# EAGLE design taad (EAGLE 6.2)
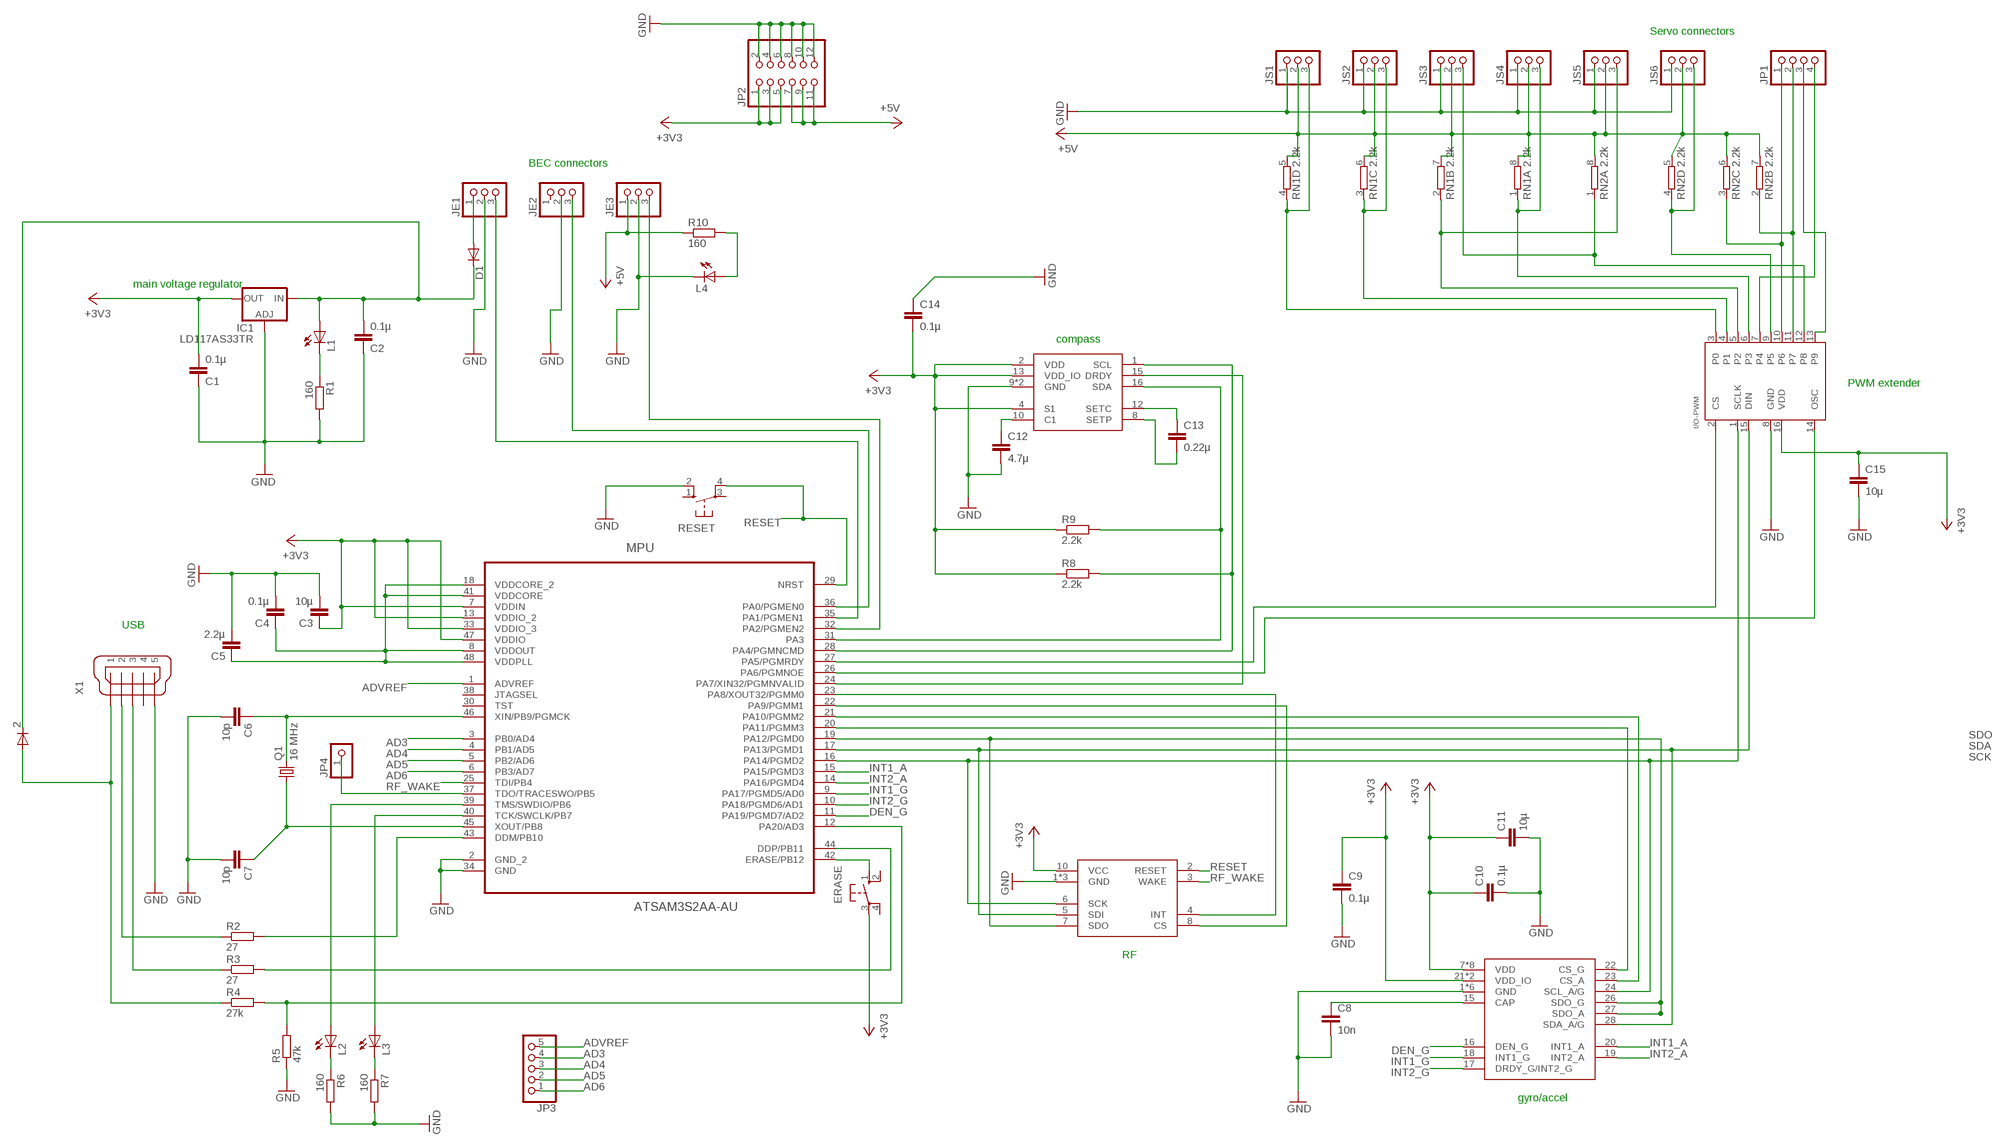
[diagram p0: schematic, sheet 1]

## Parts
2  DIODE-SOD123  [SOD123]
C1  0.1µ  C-EUC0805  [C0805]
C2  0.1µ  C-EUC0805  [C0805]
C3  10µ  C-EUC0805  [C0805]
C4  0.1µ  C-EUC0805  [C0805]
C5  2.2µ  C-EUC0805  [C0805]
C6  10p  C-EUC0805  [C0805]
C7  10p  C-EUC0805  [C0805]
C8  10n  C-EUC0805  [C0805]
C9  0.1µ  C-EUC0805  [C0805]
C10  0.1µ  C-EUC0805  [C0805]
C11  10µ  C-EUC0805  [C0805]
C12  4.7µ  C-EUC0805  [C0805]
C13  0.22µ  C-EUC0805  [C0805]
C14  0.1µ  C-EUC0805  [C0805]
C15  10µ  C-EUC0805  [C0805]
COMPASS  HMC5883L  [LPCC16]
D1  DIODE-SOD123  [SOD123]
ERASE  10-XX  [B3F-10XX]
GYRO/ACCEL  LSM330DLC  [LGA-28L]
I/O-PWM  MAX6967AEE  [QSOP16]
IC1  LD117AS33TR  [SOT223]
JE1  PINHD-1X3  [1X03]
JE2  PINHD-1X3  [1X03]
JE3  PINHD-1X3  [1X03]
JP1  PINHD-1X4  [1X04]
JP2  PINHD-2X6  [2X06]
JP3  PINHD-1X5  [1X05]
JP4  PINHD-1X1  [1X01]
JS1  PINHD-1X3  [1X03]
JS2  PINHD-1X3  [1X03]
JS3  PINHD-1X3  [1X03]
JS4  PINHD-1X3  [1X03]
JS5  PINHD-1X3  [1X03]
JS6  PINHD-1X3  [1X03]
L1  LEDCHIP-LED0805  [CHIP-LED0805]
L2  LEDCHIP-LED0805  [CHIP-LED0805]
L3  LEDCHIP-LED0805  [CHIP-LED0805]
L4  LEDCHIP-LED0805  [CHIP-LED0805]
MPU  ATSAM3S2AA-AU  [QFP50P900X900X160-48N]
Q1  16 MHz  CRYSTALHC49UP  [HC49UP]
R1  160  R-EU_R0805  [R0805]
R2  27  R-EU_R0805  [R0805]
R3  27  R-EU_R0805  [R0805]
R4  27k  R-EU_R0805  [R0805]
R5  47k  R-EU_R0805  [R0805]
R6  160  R-EU_R0805  [R0805]
R7  160  R-EU_R0805  [R0805]
R8  2.2k  R-EU_R0805  [R0805]
R9  2.2k  R-EU_R0805  [R0805]
R10  160  R-EU_R0805  [R0805]
RESET  10-XX  [B3F-10XX]
RF  MRF24J40MA_TRANSEIVER_MODULE  [PIN_HEADERS]
RN1  2.2k  4R-NEXB38V  [EXB38V]
RN2  2.2k  4R-NEXB38V  [EXB38V]
X1  MINI-USB-32005-201  [32005-201]

## Nets
+3V3: C1.2 C3.1 C9.1 C10.1 C11.1 C14.2 C15.1 COMPASS.2(VDD) COMPASS.4(S1) COMPASS.13(VDD_IO) ERASE.3(P) GYRO/ACCEL.7(VDD) GYRO/ACCEL.8(VDD) GYRO/ACCEL.9(VDD) GYRO/ACCEL.10(VDD) GYRO/ACCEL.11(VDD) GYRO/ACCEL.12(VDD) GYRO/ACCEL.13(VDD) GYRO/ACCEL.14(VDD) GYRO/ACCEL.21(VDD_IO) GYRO/ACCEL.25(VDD_IO) I/O-PWM.16(VDD) IC1.4(OUT) JP2.1 JP2.3 JP2.5 MPU.7(VDDIN) MPU.13(VDDIO_2) MPU.33(VDDIO_3) MPU.47(VDDIO) R8.1 R9.1 RF.10(VCC)
+5V: JE3.1 JP2.7 JP2.9 JP2.11 JS1.2 JS2.2 JS3.2 JS4.2 JS5.2 JS6.2 R10.1 RN1.5 RN1.6 RN1.7 RN1.8 RN2.5 RN2.6 RN2.7 RN2.8
AD3: JP3.4 MPU.3(PB0/AD4)
AD4: JP3.3 MPU.4(PB1/AD5)
AD5: JP3.2 MPU.5(PB2/AD6)
AD6: JP3.1 MPU.6(PB3/AD7)
ADVREF: JP3.5 MPU.1(ADVREF)
COMPASS_DATA_READY: COMPASS.15(DRDY) MPU.24(PA7/XIN32/PGMNVALID)
DDM: MPU.43(DDM/PB10) R2.2
DDP: MPU.44(DDP/PB11) R3.2
DEN_G: GYRO/ACCEL.16(DEN_G) MPU.11(PA19/PGMD7/AD2)
ESC1: JE1.3 MPU.35(PA1/PGMEN1)
ESC2: JE2.3 MPU.36(PA0/PGMEN0)
ESC3: JE3.3 MPU.32(PA2/PGMEN2)
GND: C1.1 C2.1 C3.2 C4.2 C5.2 C6.2 C7.2 C8.2 C9.2 C10.2 C11.2 C12.2 C14.1 C15.2 COMPASS.9(GND) COMPASS.11(GND) GYRO/ACCEL.1(GND) GYRO/ACCEL.2(GND) GYRO/ACCEL.3(GND) GYRO/ACCEL.4(GND) GYRO/ACCEL.5(GND) GYRO/ACCEL.6(GND) I/O-PWM.8(GND) IC1.1(ADJ) JE1.2 JE2.2 JE3.2 JP2.2 JP2.4 JP2.6 JP2.8 JP2.10 JP2.12 JS1.1 JS2.1 JS3.1 JS4.1 JS5.1 JS6.1 L4.C MPU.2(GND_2) MPU.34(GND) R1.2 R5.1 R6.2 R7.2 RESET.2(S1) RF.1(GND) RF.11(GND) RF.12(GND) X1.5
INT1_A: GYRO/ACCEL.20(INT1_A) MPU.15(PA15/PGMD3)
INT1_G: GYRO/ACCEL.18(INT1_G) MPU.9(PA17/PGMD5/AD0)
INT2_A: GYRO/ACCEL.19(INT2_A) MPU.14(PA16/PGMD4)
INT2_G: GYRO/ACCEL.17(DRDY_G/INT2_G) MPU.10(PA18/PGMD6/AD1)
IO1: I/O-PWM.10(P6) JP1.1 RN2.3
IO2: I/O-PWM.11(P7) JP1.2 RN2.2
IO3: I/O-PWM.13(P9) JP1.3
IO4: I/O-PWM.7(P4) JP1.4
N$1: D1.A JE1.1
N$2: L2.A MPU.39(TMS/SWDIO/PB6)
N$3: R3.1 X1.3
N$4: R2.1 X1.2
N$5: L1.C R1.1
N$6: L3.A MPU.40(TCK/SWCLK/PB7)
N$7: L4.A R10.2
N$8: L2.C R6.1
N$9: L3.C R7.1
N$10: ERASE.1(S) MPU.42(ERASE/PB12)
N$11: JP4.1 MPU.37(TDO/TRACESWO/PB5)
N$24: 2.C C2.2 D1.C IC1.3(IN) L1.A
N$25: C13.2 COMPASS.8(SETP)
N$32: C13.1 COMPASS.12(SETC)
N$33: C12.1 COMPASS.10(C1)
N$34: C8.1 GYRO/ACCEL.15(CAP)
NPCS0: GYRO/ACCEL.22(CS_G) MPU.20(PA11/PGMM3)
NPCS1: MPU.22(PA9/PGMM1) RF.8(CS)
NPCS2: GYRO/ACCEL.23(CS_A) MPU.21(PA10/PGMM2)
NPCS3: I/O-PWM.2(CS) MPU.27(PA5/PGMRDY)
PWM_CLOCK: I/O-PWM.14(OSC) MPU.26(PA6/PGMNOE)
RESET: MPU.29(NRST) RESET.4(P1) RF.2(RESET)
RF_INT: MPU.23(PA8/XOUT32/PGMM0) RF.4(INT)
RF_WAKE: MPU.25(TDI/PB4) RF.3(WAKE)
SCK: GYRO/ACCEL.24(SCL_A/G) I/O-PWM.1(SCLK) MPU.16(PA14/PGMD2) RF.6(SCK)
SDA: GYRO/ACCEL.28(SDA_A/G) I/O-PWM.15(DIN) MPU.17(PA13/PGMD1) RF.5(SDI)
SDO: GYRO/ACCEL.26(SDO_G) GYRO/ACCEL.27(SDO_A) MPU.19(PA12/PGMD0) RF.7(SDO)
SRV1: I/O-PWM.3(P0) JS1.3 RN1.4
SRV2: I/O-PWM.4(P1) JS2.3 RN1.3
SRV3: I/O-PWM.5(P2) JS5.3 RN1.2
SRV4: I/O-PWM.6(P3) JS4.3 RN1.1
SRV5: I/O-PWM.12(P8) JS3.3 RN2.1
SRV6: I/O-PWM.9(P5) JS6.3 RN2.4
TWI_CLOCK: COMPASS.1(SCL) MPU.28(PA4/PGMNCMD) R8.2
TWI_DATA: COMPASS.16(SDA) MPU.31(PA3) R9.2
USB+5V: 2.A R4.1 X1.1
USB_CONNECTED: MPU.12(PA20/AD3) R4.2 R5.2
VDDCORE: C4.1 C5.1 MPU.8(VDDOUT) MPU.18(VDDCORE_2) MPU.41(VDDCORE) MPU.48(VDDPLL)
XIN: C6.1 MPU.46(XIN/PB9/PGMCK) Q1.2
XOUT: C7.1 MPU.45(XOUT/PB8) Q1.1
Unconnected: ERASE.2(S1) ERASE.4(P1) JE2.1 MPU.30(TST) MPU.38(JTAGSEL) RESET.1(S) RESET.3(P) X1.4

## Notes on the sheet
- Servo connectors
- BEC connectors
- main voltage regulator
- compass
- PWM extender
- USB
- RF
- gyro/accel

## Library data of the parts
2 D1 = diode:DIODE-: DIODE
C1 C2 C6 C7 = resistor:C-EU: CAPACITOR, European symbol
C3-C5 C8-C15 = rcl:C-EU: CAPACITOR, European symbol
COMPASS = HMC5883L:HMC5883L
ERASE RESET = switch-omron:10-XX: OMRON SWITCH; MPN: B3F-1000; OC_FARNELL: 176432; OC_NEWARK: 36M3542
GYRO/ACCEL = LSM330DLC:LSM330DLC
I/O-PWM = max696x:MAX6967AEE
IC1 = v-reg:LD117A?*: Low drop fixed and adjustable positive voltage regulators 1 A Source: http://www.st.com/stonline/products/literature/ds/7194/ld1117axx.pdf
JE1-JE3 JS1-JS6 = pinhead:PINHD-1X3: PIN HEADER
JP1 = pinhead:PINHD-1X4: PIN HEADER
JP2 = pinhead:PINHD-2X6: PIN HEADER
JP3 = pinhead:PINHD-1X5: PIN HEADER
JP4 = pinhead:PINHD-1X1: PIN HEADER
L1-L4 = led:LED: LED OSRAM: - CHIPLED LG R971, LG N971, LY N971, LG Q971, LY Q971, LO R971, LY R971 LH N974, LH R974 LS Q976, LO Q976, LY Q976 LO Q996 - Hyper CHIPLED LW Q18S LB Q993, LB Q99A, LB R99A - SideLED LS A670, LO A670, LY A670, LG A670, LP A670 LB A673, LV A673, LT A673, LW A673 LH A674 LY A675 LS A676, LA A676, LO A676, LY A676, LW A676 LS A679, LY A679, LG A679 - Hyper Micro SIDELED® LS Y876, LA Y876, LO Y876, LY Y876 LT Y87S - SmartLED LW L88C, LW L88S LB L89C, LB L89S, LG L890 LS L89K, LO L89K, LY L89K LS L896, LA L896, LO L896, LY L896 - TOPLED LS T670, LO T670, LY T670, LG T670, LP T670 LSG T670, LSP T670, LSY T670, LOP T670, LYG T670 LG T671, LOG T671, LSG T671 LB T673, LV T673, LT T673, LW T673 LH T674 LS T676, LA T676, LO T676, LY T676, LB T676, LH T676, LSB T676, LW T676 LB T67C, LV T67C, LT T67C, LS T67K, LO T67K, LY T67K, LW E67C LS E67B, LA E67B, LO E67B, LY E67B, LB E67C, LV E67C, LT E67C LW T67C LS T679, LY T679, LG T679 LS T770, LO T770, LY T770, LG T770, LP T770 LB T773, LV T773, LT T773, LW T773 LH T774 LS E675, LA E675, LY E675, LS T675 LS T776, LA T776, LO T776, LY T776, LB T776 LHGB T686 LT T68C, LB T68C - Hyper Mini TOPLED® LB M676 - Mini TOPLED Santana® LG M470 LS M47K, LO M47K, LY M47K Source: http://www.osram.convergy.de LUXEON: - LUMILED® LXK2-PW12-R00, LXK2-PW12-S00, LXK2-PW14-U00, LXK2-PW14-V00 LXK2-PM12-R00, LXK2-PM12-S00, LXK2-PM14-U00 LXK2-PE12-Q00, LXK2-PE12-R00, LXK2-PE12-S00, LXK2-PE14-T00, LXK2-PE14-U00 LXK2-PB12-K00, LXK2-PB12-L00, LXK2-PB12-M00, LXK2-PB14-N00, LXK2-PB14-P00, LXK2-PB14-Q00 LXK2-PR12-L00, LXK2-PR12-M00, LXK2-PR14-Q00, LXK2-PR14-R00 LXK2-PD12-Q00, LXK2-PD12-R00, LXK2-PD12-S00 LXK2-PH12-R00, LXK2-PH12-S00 LXK2-PL12-P00, LXK2-PL12-Q00, LXK2-PL12-R00 Source: www.luxeon.com KINGBRIGHT: KA-3528ASYC Source: www.kingbright.com
MPU = ATSAM3S2AA-AU:ATSAM3S2AA-AU: Flash MCU; DESCRIPTION: Flash MCU; MPN: ATSAM3S2AA-AU; OC_FARNELL: 1841652; OC_NEWARK: 12T1310; PACKAGE: QFP-48; SUPPLIER: Atmel
Q1 = crystal:CRYSTAL: CRYSTAL; OC_FARNELL: unknown; OC_NEWARK: unknown
R1-R10 = resistor:R-EU_: RESISTOR, European symbol
RF = MRF24J40MA:MRF24J40MA_TRANSEIVER_MODULE
RN1 RN2 = resistor-dil:4R-N: Array Chip Resistor Source: RS Component / Phycomp; OC_FARNELL: unknown; OC_NEWARK: unknown
X1 = con-cypressindustries:MINI-USB-: MINI USB-B Conector Source: www.cypressindustries.com; OC_FARNELL: unknown; OC_NEWARK: unknown

## Board
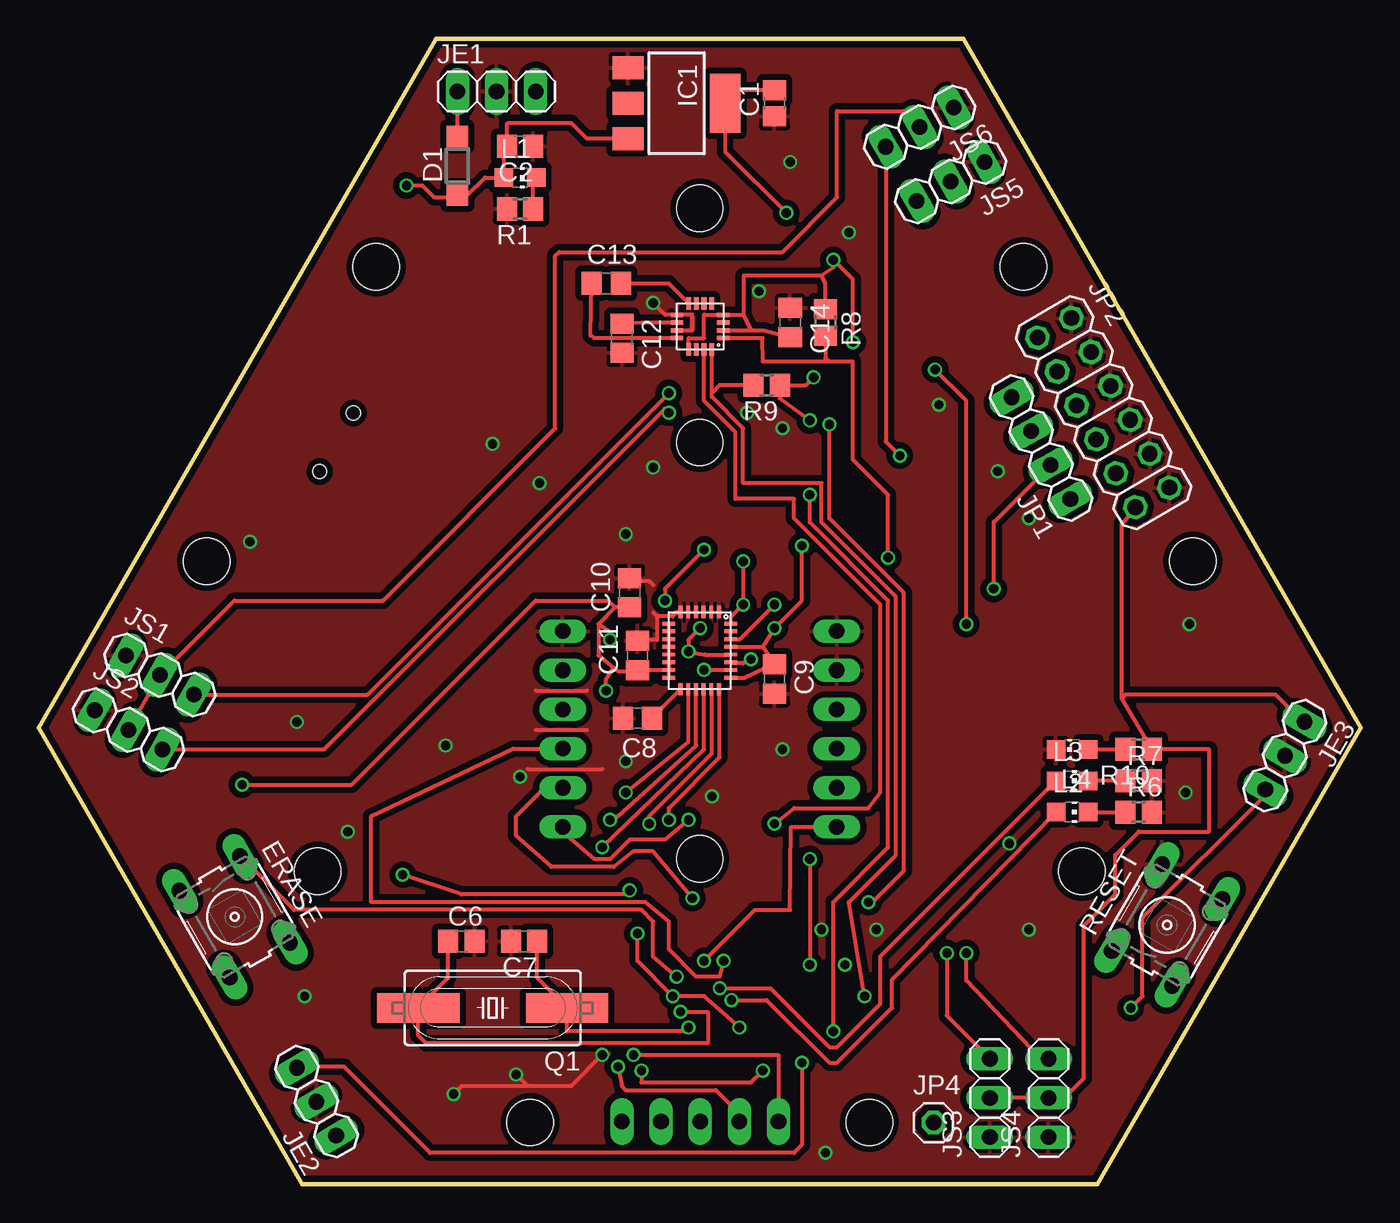
[diagram p1: board, top side]
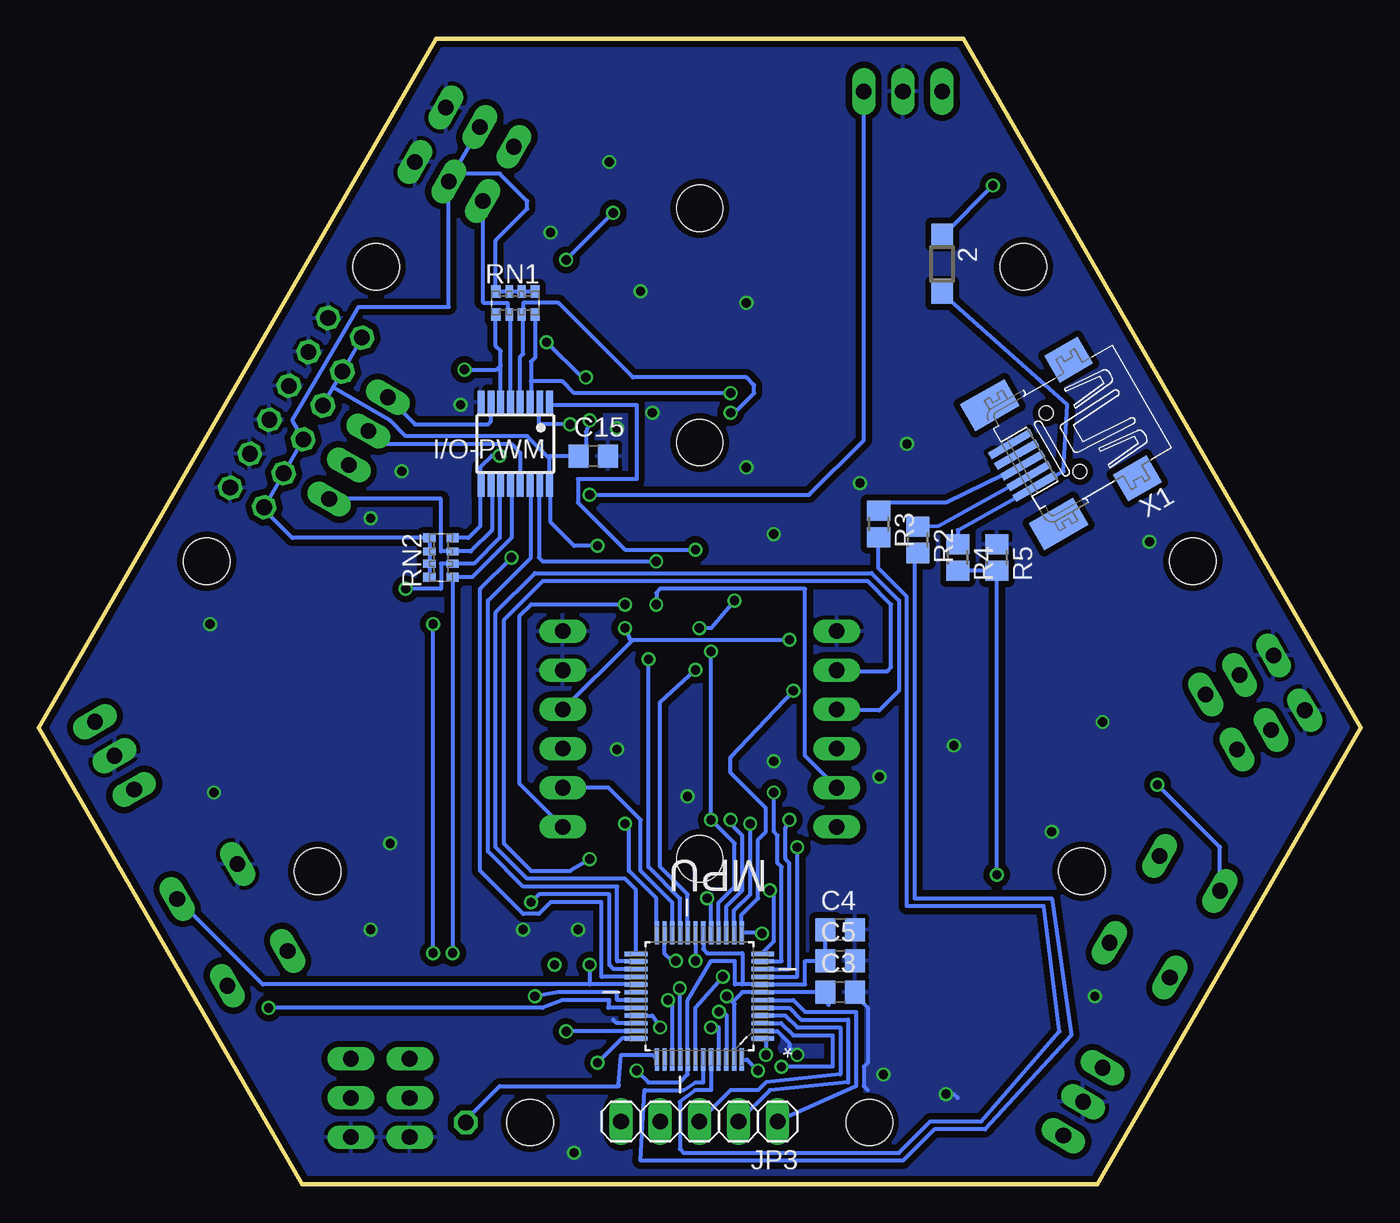
[diagram p2: board, bottom side, seen from below]

Size 85.8 x 74.3 mm. Coordinates in mm from the lower left corner, seen from the top.
Outline: 0,29.6 25.8,74.3 60,74.3 85.8,29.6 68.7,0 17.1,0 0,29.6
Copper layers (1*16): Top 0.035mm / dielectric 1.5mm / Bottom 0.035mm
Design rules: minimum track width 6mil, minimum drill 12mil, track to track 6mil, track to pad 6mil, pad to pad 6mil, via to via 6mil, smd to smd 0mil, copper to edge 10mil, drill to drill 10mil, minimum pad ring 10mil, minimum via ring 6mil, stop-mask expansion 2mil, vias tented up to drill 100mil, thermal gap 10mil
Holes 3 mm at 31.9,4 53.9,4 10.9,40.4 21.9,59.5 63.9,59.5 74.9,40.4 42.9,48.1 42.9,21.1 18.1,20.3 67.7,20.3 42.9,63.3

### Footprints (pad centres in the part's own frame; a part is rotated, then mirrored left to right if it is on the bottom)
SOD123 = smd 1.4 x 1.4: A 1.9,0; C -1.9,0
C0805 = smd 1.3 x 1.5: 1 -0.85,0; 2 0.85,0
C0805' = smd 1.3 x 1.5: 1 -0.95,0; 2 0.95,0
LPCC16 = smd 0.8 x 0.3: 1 -1.5,0.75; 2 -1.5,0.25; 3 -1.5,-0.25; 4 -1.5,-0.75; 9 1.5,-0.75; 10 1.5,-0.25; 11 1.5,0.25; 12 1.5,0.75 | smd 0.3 x 0.8: 5 -0.75,-1.5; 6 -0.25,-1.5; 7 0.25,-1.5; 8 0.75,-1.5; 13 0.75,1.5; 14 0.25,1.5; 15 -0.25,1.5; 16 -0.75,1.5
B3F-10XX = drill 1.016 long: 1 -3.251,2.261; 2 3.251,2.261; 3 -3.251,-2.261; 4 3.251,-2.261
LGA-28L = smd 0.8 x 0.25: 1 2.5,-1.25; 2 2.5,-0.75; 3 2.5,-0.25; 4 2.5,0.25; 5 2.5,0.75; 6 2.5,1.25; 15 -2.5,1.25; 16 -2.5,0.75; 17 -2.5,0.25; 18 -2.5,-0.25; 19 -2.5,-0.75; 20 -2.5,-1.25 | smd 0.25 x 0.8: 7 1.75,2; 8 1.25,2; 9 0.75,2; 10 0.25,2; 11 -0.25,2; 12 -0.75,2; 13 -1.25,2; 14 -1.75,2; 21 -1.75,-2; 22 -1.25,-2; 23 -0.75,-2; 24 -0.25,-2; 25 0.25,-2; 26 0.75,-2; 27 1.25,-2; 28 1.75,-2
QSOP16 = smd 0.45 x 1.5: 1 -2.223,-2.69; 2 -1.587,-2.69; 3 -0.953,-2.69; 4 -0.318,-2.69; 5 0.318,-2.69; 6 0.953,-2.69; 7 1.587,-2.69; 8 2.223,-2.69; 9 2.223,2.69; 10 1.587,2.69; 11 0.953,2.69; 12 0.318,2.69; 13 -0.318,2.69; 14 -0.953,2.69; 15 -1.587,2.69; 16 -2.223,2.69
SOT223 = smd 1.5 x 2: 1 -2.3,-3.15; 2 0,-3.15; 3 2.3,-3.15 | smd 3.8 x 2: 4 0,3.15
1X03 = drill 1.016 long: 1 -2.54,0; 2 0,0; 3 2.54,0
1X04 = drill 1.016 long: 1 -3.81,0; 2 -1.27,0; 3 1.27,0; 4 3.81,0
2X06 = drill 1.016 octagon: 1 -6.35,-1.27; 2 -6.35,1.27; 3 -3.81,-1.27; 4 -3.81,1.27; 5 -1.27,-1.27; 6 -1.27,1.27; 7 1.27,-1.27; 8 1.27,1.27; 9 3.81,-1.27; 10 3.81,1.27; 11 6.35,-1.27; 12 6.35,1.27
1X05 = drill 1.016 long: 1 -5.08,0; 2 -2.54,0; 3 0,0; 4 2.54,0; 5 5.08,0
1X01 = drill 1.016 octagon: 1 0,0
CHIP-LED0805 = smd 1.2 x 1.2: A 0,-1.05; C 0,1.05
QFP50P900X900X160-48N = smd 1.473 x 0.279: 1 -4.115,2.743; 2 -4.115,2.261; 3 -4.115,1.753; 4 -4.115,1.245; 5 -4.115,0.762; 6 -4.115,0.254; 7 -4.115,-0.254; 8 -4.115,-0.762; 9 -4.115,-1.245; 10 -4.115,-1.753; 11 -4.115,-2.261; 12 -4.115,-2.743; 25 4.115,-2.743; 26 4.115,-2.261; 27 4.115,-1.753; 28 4.115,-1.245; 29 4.115,-0.762; 30 4.115,-0.254; 31 4.115,0.254; 32 4.115,0.762; 33 4.115,1.245; 34 4.115,1.753; 35 4.115,2.261; 36 4.115,2.743 | smd 0.279 x 1.473: 13 -2.743,-4.115; 14 -2.261,-4.115; 15 -1.753,-4.115; 16 -1.245,-4.115; 17 -0.762,-4.115; 18 -0.254,-4.115; 19 0.254,-4.115; 20 0.762,-4.115; 21 1.245,-4.115; 22 1.753,-4.115; 23 2.261,-4.115; 24 2.743,-4.115; 37 2.743,4.115; 38 2.261,4.115; 39 1.753,4.115; 40 1.245,4.115; 41 0.762,4.115; 42 0.254,4.115; 43 -0.254,4.115; 44 -0.762,4.115; 45 -1.245,4.115; 46 -1.753,4.115; 47 -2.261,4.115; 48 -2.743,4.115
HC49UP = smd 5.334 x 1.93: 1 -4.826,0; 2 4.826,0
R0805 = smd 1.3 x 1.5: 1 -0.85,0; 2 0.85,0
PIN_HEADERS = drill 1.016 long: 1 -8.89,6.35; 2 -8.89,3.81; 3 -8.89,1.27; 4 -8.89,-1.27; 5 -8.89,-3.81; 6 -8.89,-6.35; 7 8.89,-6.35; 8 8.89,-3.81; 9 8.89,-1.27; 10 8.89,1.27; 11 8.89,3.81; 12 8.89,6.35
EXB38V = smd 0.6 x 0.8: 1 -1.275,-0.75; 4 1.275,-0.75; 5 1.275,0.75; 8 -1.275,0.75 | smd 0.5 x 0.8: 2 -0.4,-0.75; 3 0.4,-0.75; 6 0.4,0.75; 7 -0.4,0.75
32005-201 = smd 3.1 x 0.5: 1 3,1.6; 2 3,0.8; 3 3,0; 4 3,-0.8; 5 3,-1.6 | smd 2.5 x 2: M1 -3,-4.45; M2 -3,4.45 | smd 3.3 x 2: M3 2.9,4.45; M4 2.9,-4.45 | hole 0.9: 0,2.2; 0,-2.2

### Placement (x,y rotation side)
2  27.18,59.69 270 bottom
C1  100n  [C0805]  47.75,70.1 90 top
C2  100n  [C0805]  31.24,67.31 180 top
C3  10µ  [C0805']  33.78,12.45 0 bottom
C4  100n  [C0805']  33.78,16.51 0 bottom
C5  2.2µ  [C0805']  33.78,14.48 0 bottom
C6  27.43,15.75 0 top
C7  31.5,15.75 180 top
C8  10n  [C0805']  38.86,30.22 180 top
C9  100n  [C0805']  47.75,32.77 270 top
C10  100n  [C0805']  38.35,38.35 90 top
C11  10µ  [C0805']  38.86,34.29 90 top
C12  4.7µ  [C0805']  37.85,54.86 270 top
C13  0.22µ  [C0805']  36.83,58.42 0 top
C14  0.1µ  [C0805']  48.77,55.88 270 top
C15  10µ  [C0805']  49.8,47.21 0 bottom
COMPASS  42.93,55.63 180 top
D1  27.18,66.04 90 top
ERASE  12.73,17.34 300 top
GYRO/ACCEL  42.9,34.6 90 top
I/O-PWM  54.86,48.01 180 bottom
IC1  41.4,70.1 270 top
JE1  29.72,70.87 0 top
JE2  18.03,5.35 120 top
JE3  80.86,27.79 240 top
JP1  65.04,47.74 120 top
JP2  69.09,50.04 300 top
JP3  42.93,4.06 180 bottom
JP4  58.07,3.99 0 top
JS1  7.87,33.02 330 top
JS2  5.84,29.46 330 top
JS3  61.72,5.59 90 top
JS4  65.53,5.59 90 top
JS5  59.18,65.02 210 top
JS6  57.17,68.56 210 top
L1  31.24,65.28 270 top
L2  67.06,24.13 270 top
L3  67.06,26.16 270 top
L4  67.06,28.19 90 top
MPU  42.93,12.19 180 bottom
Q1  29.46,11.43 180 top
R1  31.24,63.25 180 top
R2  28.75,41.78 270 bottom
R3  31.29,42.82 270 bottom
R4  26.16,40.64 270 bottom
R5  23.62,40.64 270 bottom
R6  71.37,24.13 0 top
R7  71.37,26.16 0 top
R8  51.05,55.88 270 top
R9  47.24,51.82 180 top
R10  71.37,28.19 180 top
RESET  73.22,16.81 60 top
RF  42.9,29.52 0 top
RN1  54.86,57.15 0 bottom
RN2  59.69,40.64 90 bottom
X1  19.34,48.12 210 bottom

### Tracks (layer width: path | path; a pad name or v marks a point on that pad's centre or on a via)
+3V3  (via drill 0.6 pad 0.25)
  Top 0.254: v38.86,16.26 38.86,14.48 v41.15,12.19 43.18,12.19 45.21,10.41 v45.47,10.16 | GYRO/ACCEL.13 C11.1 38.8,33.27 37.59,33.27 37.31,33.5 | GYRO/ACCEL.12 GYRO/ACCEL.13 | GYRO/ACCEL.13 GYRO/ACCEL.14 GYRO/ACCEL.11 GYRO/ACCEL.10 GYRO/ACCEL.9 GYRO/ACCEL.8 GYRO/ACCEL.7 | GYRO/ACCEL.25 46.99,34.85 | 46.99,34.85 C9.1 47.31,33.53 47.24,33.53 45.8,32.85 GYRO/ACCEL.21 | C10.1 37.4,37.4 | 37.4,37.4 36.32,36.32 | 36.32,36.32 36.32,34.29 37.31,33.5 | v37.08,35.31 37.08,35.81 36.32,36.32 | v13.21,25.91 20.32,25.91 32.26,37.85 36.96,37.85 37.4,37.4 | COMPASS.2 46.23,55.38 | 46.23,55.38 47.06,55.38 C14.2 | COMPASS.13 42.18,54.88 43.18,54.86 43.18,56.39 44.41,56.39 COMPASS.4 45.74,56.38 | 45.74,56.38 46.23,55.38 | v50.04,49.53 48.09,50.97 R9.1 49.78,51.82 v50.29,52.32 | R8.1 51.05,58.42 50.8,58.93 | 50.8,58.93 45.75,58.93 45.74,56.38 | C1.2 45.4,70.95 IC1.4 44.55,66.95 v48.51,62.99 | 50.8,58.93 51.56,59.44 v51.56,59.94 52.83,58.67 v52.83,54.61 | 46.99,34.85 v47.75,36.07 49.53,37.85 v49.53,41.4 | v36.83,32 36.83,32.76 37.31,33.5
  Bottom 0.254: 34.54,11.62 C3.1 MPU.7 40.13,12.45 40.77,11.81 | MPU.47 40.64,8.1 40.64,11.68 40.77,11.81 | 40.77,11.81 v41.15,12.19 | v38.86,16.26 38.91,16.31 MPU.13 40.18,17.48 39.12,18.54 39.12,22.35 38.61,22.86 38.61,24.38 40.89,26.67 40.89,27.69 v36.83,32 | RF.10 51.76,30.79 47.37,35.18 | 47.37,35.18 47.24,35.31 v37.08,35.31 | JP2.1 JP2.3 66.68,51.67 | 66.68,51.67 JP2.5 | 52.64,47.05 I/O-PWM.16 52.58,45.25 52.58,42.93 51.05,41.4 v49.53,41.4 | 52.64,47.05 54.1,48.51 61.98,48.51 62.99,49.53 66.68,51.67 | 52.64,47.05 52.64,47.21 C15.1 50.29,47.67 50.29,48.77 v50.04,49.53 | ERASE.3 9.15,21.85 v13.21,25.91 | v48.51,62.99 v51.56,59.94 | v50.29,52.32 50.55,52.32 v52.83,54.61 | v47.75,36.07 47.37,35.18 | MPU.33 47.02,10.95 46.99,10.92 45.97,10.92 v45.47,10.16
+5V
  Top 0.254: JS2.2 JS1.2 12.7,37.85 22.35,37.85 33.53,49.02 33.53,60.2 33.78,60.45 48.26,60.45 51.82,64.01 51.82,69.6 56.13,69.6 JS6.2 | 70.27,31.5 R10.1 75.95,28.19 75.95,22.86 71.37,22.86 69.85,21.34 69.85,18.8 67.82,16.76 67.82,6.86 66.55,5.59 JS4.2 JS3.2 | 70.27,31.5 70.27,42.84 70.87,43.43 70.87,43.61 JP2.11 | JE3.1 82.03,29.99 80.26,31.75 70.52,31.75 70.27,31.5
  Bottom 0.254: RN2.8 RN2.7 RN2.6 RN2.5 69.34,41.91 71.16,43.73 JP2.11 JP2.9 JP2.7 69.34,49.53 65.02,56.9 59.18,56.9 JS5.2 | RN1.5 RN1.6 RN1.7 RN1.8 56.14,61.21 54.1,63.25 54.1,63.75 55.88,65.53 58.67,65.53 JS5.2 | JS5.2 JS6.2
AD3  (via drill 0.6 pad 0.25)
  Top 0.254: v37.59,7.62 37.85,6.35 38.1,6.1 43.94,6.1 45.47,4.57 JP3.4
  Bottom 0.254: MPU.3 37.62,10.44 36.83,9.65 34.29,9.65 34.29,7.62 v37.59,7.62
AD4
  Bottom 0.254: MPU.4 37.36,10.95 36.58,10.16 33.78,10.16 33.78,7.11 38.61,6.6 39.12,6.1 40.89,6.1 JP3.3
AD5
  Bottom 0.254: MPU.5 37.08,11.43 36.32,10.67 33.27,10.67 33.27,6.6 38.35,6.1 JP3.2
AD6
  Bottom 0.254: MPU.6 36.83,11.94 36.07,11.18 32.77,11.18 32.77,6.35 JP3.1
ADVREF  (via drill 0.6 pad 0.25)
  Top 0.254: v38.61,8.38 48.01,8.38 JP3.5
  Bottom 0.254: MPU.1 38.61,9.25 v38.61,8.38
COMPASS_DATA_READY  (via drill 0.6 pad 0.25)
  Top 0.254: v47.75,23.37 49.02,24.38 53.85,24.38 54.61,25.4 54.61,37.59 49.02,43.18 49.02,44.45 45.21,44.45 45.21,48.77 43.18,50.8 COMPASS.15
  Bottom 0.254: MPU.24 45.72,16.36 45.72,18.54 47.5,20.32 47.5,23.11 v47.75,23.37
DDM
  Bottom 0.254: R2.2 28.96,40.73 28.96,18.54 20.07,18.54 18.8,9.65 24.38,3.56 27.69,3.56 29.72,1.52 46.74,1.52 46.48,6.1 43.94,6.1 43.18,6.6 42.67,6.6 MPU.43
DDP
  Bottom 0.254: MPU.44 42.16,6.1 43.18,6.1 44.2,5.33 44.2,2.29 43.94,2.03 29.97,2.03 27.94,4.06 24.64,4.06 19.56,9.91 20.57,18.03 29.46,18.03 29.46,38.1 31.29,39.93 R3.2
DEN_G  (via drill 0.6 pad 0.25)
  Top 0.254: v38.1,25.4 42.16,28.7 42.16,32.09 GYRO/ACCEL.16
  Bottom 0.254: MPU.11 37.62,14.45 37.59,14.48 37.59,20.57 37.85,20.83 37.85,22.61 38.1,22.86 v38.1,25.4
ESC1  (via drill 0.6 pad 0.25)
  Top 0.254: v51.56,9.91 51.56,18.29 55.12,21.84 55.12,37.85 50.04,42.93 v50.04,44.7
  Bottom 0.254: MPU.35 47.07,9.91 v51.56,9.91 | v50.04,44.7 35.81,44.7 32.26,48.26 JE1.3
ESC2  (via drill 0.6 pad 0.25)
  Top 0.254: v49.53,7.87 49.53,2.54 49.02,2.03 25.4,2.03 19.81,7.62 16.84,7.62 JE2.3
  Bottom 0.254: MPU.36 47.95,9.45 v49.53,7.87
ESC3  (via drill 0.6 pad 0.25)
  Top 0.254: v70.87,11.43 71.63,12.19 71.63,17.27 79.59,25.24 JE3.3
  Bottom 0.254: MPU.32 48.82,11.43 48.77,11.94 51.82,11.94 53.09,11.43 v70.87,11.43
GND  (via drill 0.6 pad 0.25)
  Top 0.254: COMPASS.11 42.41,55.38 42.42,55.37 42.42,56.39 COMPASS.9 40.65,56.38 v39.88,57.15 | GYRO/ACCEL.6 41.42,37.1 41.15,36.83 40.13,36.83 | 40.13,36.83 40.13,35.31 38.93,35.31 C11.2 | 40.13,36.83 39.88,37.08 | 39.88,38.86 39.62,39.12 38.54,39.12 C10.2 | v36.58,8.38 34.54,6.35 31.75,6.35 | 31.75,6.35 27.43,6.35 v26.92,5.84 | 31.75,6.35 v30.99,7.11 | 31.75,26.92 36.58,26.92 | 32.26,29.46 35.56,29.46 | 32.26,32 35.56,32
  Bottom 0.254: MPU.34 48.28,10.44 48.51,10.67 | MPU.2 37.87,9.93 37.08,9.14 37.08,8.89 v36.58,8.38 | C3.2 32.83,12.38 33.02,12.19 32.77,12.19 32,11.43 32,7.87 32.26,7.62 32.26,6.35 32,6.1 | v26.92,5.84 26.42,5.84 26.16,5.59 | v30.99,7.11 30.99,7.37
  other vias: 58.42,50.55 74.42,25.4 45.97,50.04 48.26,49.02 39.88,46.48 29.46,48.01 32.51,45.47 38.1,42.16 46.74,57.91 52.58,61.72 48.77,66.29 38.1,27.43 43.69,25.15 48.26,28.19 31.24,26.42 17.27,12.19 20.07,22.86 74.68,36.32 64.26,16.51 51.05,2.03 13.72,41.66 16.76,29.97 62.99,22.1 54.36,16.51 50.8,16.51 62.23,46.23 26.42,28.45 64.26,43.18
  pour Bottom (isolate 0.406): 88.65,81.53 88.9,81.28 88.9,-5.08
  pour Bottom (isolate 0.406): -1.27,-1.27 -1.27,76.2 88.9,76.2 88.9,-1.27
  pour Top (isolate 0.406): -1.02,-1.02 -1.02,76.45 89.15,76.45 89.15,-1.02
INT1_A  (via drill 0.6 pad 0.25)
  Top 0.254: v40.89,23.62 40.89,24.38 44.2,27.69 44.2,32.05 GYRO/ACCEL.20
  Bottom 0.254: MPU.15 41.17,18.01 40.13,19.05 40.13,22.61 40.64,23.11 v40.89,23.62
INT1_G  (via drill 0.6 pad 0.25)
  Top 0.254: v36.58,21.84 43.18,28.19 43.18,32.07 GYRO/ACCEL.18
  Bottom 0.254: MPU.9 36.6,13.44 36.58,13.46 v36.58,21.84
INT2_A  (via drill 0.6 pad 0.25)
  Top 0.254: v39.62,23.37 39.62,23.88 43.69,27.94 43.69,32.06 GYRO/ACCEL.19
  Bottom 0.254: MPU.14 40.66,17.75 39.62,18.8 v39.62,23.37
INT2_G  (via drill 0.6 pad 0.25)
  Top 0.254: v37.08,23.62 37.59,23.88 42.67,28.45 42.67,32.08 GYRO/ACCEL.17
  Bottom 0.254: MPU.10 37.11,13.95 37.08,13.97 37.08,20.83 37.34,21.08 37.34,23.11 v37.08,23.62
IO1
  Bottom 0.254: I/O-PWM.10 56.39,45.25 56.39,42.42 57.77,41.04 RN2.3 59.69,41.04 59.69,44.45 JP1.1
IO2  (via drill 0.6 pad 0.25)
  Top 0.254: v61.98,38.61 61.98,42.94 JP1.2
  Bottom 0.254: I/O-PWM.11 55.88,45.25 55.88,41.91 57.55,40.24 RN2.2 59.69,40.24 59.69,38.61 v61.98,38.61
IO3
  Bottom 0.254: JP1.3 63.57,48.01 55.12,48.01 54.55,47.43 I/O-PWM.13
IO4
  Bottom 0.254: JP1.4 61.37,49.28 56.64,49.28 56.45,49.47 I/O-PWM.7
N$1
  Top 0.254: D1.A JE1.1
N$2  (via drill 0.6 pad 0.25)
  Top 0.254: v44.96,11.94 47.24,11.94 51.31,7.87 51.82,7.87 55.37,11.43 55.37,13.24 L2.A
  Bottom 0.254: MPU.39 44.68,11.66 v44.96,11.94
N$3
  Bottom 0.254: X1.3 26.92,44.2 30.76,44.2 R3.1
N$4
  Bottom 0.254: X1.2 27.43,42.67 R2.1
N$5
  Top 0.254: R1.1 32.09,65.08 L1.C
N$6  (via drill 0.6 pad 0.25)
  Top 0.254: v44.2,12.7 47.5,12.7 51.31,8.89 51.82,8.89 54.61,11.68 54.61,14.77 L3.A
  Bottom 0.254: MPU.40 44.17,12.68 v44.2,12.7
N$7
  Top 0.254: L4.A R10.2
N$8
  Top 0.254: L2.C R6.1
N$9
  Top 0.254: R7.1 L3.C
N$10  (via drill 0.6 pad 0.25)
  Top 0.254: v41.4,13.46 39.88,14.73 39.88,17.02 39.12,17.78 16.57,17.78 ERASE.1
  Bottom 0.254: MPU.42 43.18,11.43 v41.4,13.46
N$11
  Bottom 0.254: JP4.1 58.07,4.16 55.88,6.35 48.16,6.35 48.16,6.45 48.01,8.38 45.97,8.38 MPU.37
N$13  (via drill 0.6 pad 0.25)
  other vias: 52.32,14.22
N$24  (via drill 0.6 pad 0.25)
  Top 0.254: v23.88,64.77 24.89,64.77 25.65,64.01 27.05,64.01 D1.C 27.82,64.14 28.96,65.28 L1.A 30.19,67.11 C2.2 30.39,68.75 30.48,68.83 34.54,68.83 35.56,67.82 38.24,67.82 IC1.3
  Bottom 0.254: 2.C 27.06,61.59 v23.88,64.77
N$25
  Top 0.254: C13.2 40.88,58.42 COMPASS.8
N$32
  Top 0.254: COMPASS.12 37.33,54.88 36.07,54.86 35.81,55.05 C13.1
N$33
  Top 0.254: COMPASS.10 39.18,55.88 C12.1
N$34
  Top 0.254: GYRO/ACCEL.15 39.81,30.26 C8.1
NPCS0  (via drill 0.6 pad 0.25)
  Top 0.254: v43.18,33.35 44.82,33.35 GYRO/ACCEL.22
  Bottom 0.254: MPU.20 43.69,18.8 45.47,20.57 45.47,31.24 v43.18,33.35
NPCS1
  Bottom 0.254: MPU.22 44.68,18.26 46.74,20.32 46.74,23.62 48.82,25.71 RF.8
NPCS2  (via drill 0.6 pad 0.25)
  Top 0.254: v46.23,34.04 45.72,33.78 44.97,33.78 GYRO/ACCEL.23
  Bottom 0.254: MPU.21 44.17,18.52 46.23,20.57 v46.23,34.04
NPCS3  (via drill 0.6 pad 0.25)
  Top 0.254: v53.85,18.29 54.1,18.29 56.13,20.32 56.13,38.35 51.31,43.18 v51.31,49.28
  Bottom 0.254: MPU.27 48.49,13.95 48.77,14.22 48.77,18.8 53.34,18.8 v53.85,18.29 | v51.31,49.28 53.34,49.28 53.34,50.63 I/O-PWM.2
PWM_CLOCK
  Bottom 0.254: MPU.26 48.23,14.45 48.26,14.48 48.26,19.3 54.36,19.3 56.64,21.59 56.64,37.85 53.85,40.64 53.85,45.25 I/O-PWM.14
RESET  (via drill 0.6 pad 0.25)
  Top 0.254: v50.04,21.08 v50.04,14.22
  Bottom 0.254: MPU.29 50.04,12.95 | 50.04,12.95 71.26,12.95 RESET.4 | RF.2 33.95,33.27 30.73,33.27 30.48,33.53 30.48,37.59 32,39.12 53.09,39.12 55.63,36.58 55.63,22.1 53.85,20.32 51.31,20.32 v50.04,21.08 | v50.04,14.22 50.04,12.95
RF_INT  (via drill 0.6 pad 0.25)
  Top 0.254: v44.45,14.48 44.2,13.46 42.67,13.46 40.89,15.24 40.89,17.02 39.37,18.29 21.59,18.29 21.59,23.88 30.79,28.25 RF.4
  Bottom 0.254: MPU.23 45.21,16.28 45.21,14.99 44.7,14.48 v44.45,14.48
RF_WAKE
  Bottom 0.254: MPU.25 47.04,19.1 47.75,19.81 54.1,19.81 56.13,21.84 56.13,37.08 53.59,39.62 31.75,39.62 29.97,37.85 29.97,32 31.24,30.73 33.95,30.73 RF.3
SCK  (via drill 0.6 pad 0.25)
  Top 0.254: v42.16,23.62 40.64,22.35 38.35,22.35 37.08,21.08 36.07,21.08 34.29,22.61 34.29,22.89 RF.6 | GYRO/ACCEL.24 43.24,34.35 v42.16,34.54 42.16,35.31 v42.93,36.07 | v43.18,41.15 40.64,38.61 v40.64,37.85
  Bottom 0.254: MPU.16 41.68,18.26 40.64,19.3 40.64,22.1 v42.16,23.62 v42.16,34.54 | I/O-PWM.1 52.49,50.55 46.99,50.55 46.99,45.72 50.8,45.72 50.8,44.2 47.75,41.15 v43.18,41.15 | v40.64,37.85 42.16,36.07 v42.93,36.07
SDA  (via drill 0.6 pad 0.25)
  Top 0.254: v42.42,18.54 39.88,21.59 38.61,21.59 37.34,20.57 33.27,20.57 30.99,22.61 30.99,23.88 32.82,25.71 RF.5 | GYRO/ACCEL.28 44.9,36.77 v45.72,37.59 v45.72,40.39
  Bottom 0.254: MPU.17 42.16,18.8 v42.42,18.54 | RF.5 36.07,27.77 36.07,38.61 45.47,38.61 45.72,38.35 v45.72,37.59 | I/O-PWM.15 53.34,45.25 53.34,40.64 53.09,40.39 v45.72,40.39
SDO  (via drill 0.6 pad 0.25)
  Top 0.254: v43.18,14.48 46.48,17.78 48.77,17.78 48.82,23.17 RF.7 | GYRO/ACCEL.27 GYRO/ACCEL.26 45.51,35.35 v47.75,37.59
  Bottom 0.254: MPU.19 v43.18,14.48 | v47.75,37.59 53.85,37.59 54.61,36.83 54.61,25.99 RF.7
SRV1  (via drill 0.6 pad 0.25)
  Top 0.254: JS1.3 21.34,31.75 v40.89,51.31
  Bottom 0.254: RN1.4 53.59,56.39 53.59,53.59 53.85,53.34 53.85,52.07 | 53.85,52.07 53.85,50.76 I/O-PWM.3 | v40.89,51.31 51.05,51.31 51.82,52.07 53.85,52.07
SRV2  (via drill 0.6 pad 0.25)
  Top 0.254: JS2.3 18.54,28.19 40.64,50.29 v40.89,50.04
  Bottom 0.254: I/O-PWM.4 54.55,53.66 54.36,53.85 54.36,56.29 RN1.3 54.36,56.51 54.36,57.15 52.07,57.15 47.24,52.32 39.88,52.32 39.37,51.82 39.37,51.31 40.64,50.04 v40.89,50.04
SRV3
  Bottom 0.254: I/O-PWM.5 55.18,56.32 RN1.2 55.37,56.51 55.37,57.15 56.9,57.15 56.98,57.24 JS5.3
SRV4  (via drill 0.6 pad 0.25)
  Top 0.254: JS4.3 65.02,8.13 60.2,13.21 v60.2,14.99 | v58.17,52.83 60.2,50.8 v60.2,36.32
  Bottom 0.254: I/O-PWM.6 55.82,53.09 | 55.82,53.09 55.82,54.04 56.13,54.36 RN1.1 | v58.17,52.83 56.07,52.83 55.82,53.09 | v60.2,14.99 v60.2,36.32
SRV5  (via drill 0.6 pad 0.25)
  Top 0.254: v58.93,14.99 58.93,10.92 JS3.3
  Bottom 0.254: I/O-PWM.12 55.12,45.25 55.12,41.91 57.66,39.37 RN2.1 v58.94,15 v58.93,14.99
SRV6  (via drill 0.6 pad 0.25)
  Top 0.254: JS6.3 54.97,48.16 v55.88,47.24
  Bottom 0.254: RN2.4 57.91,41.91 57.15,42.67 57.15,45.25 I/O-PWM.9 57.15,45.38 57.15,46.48 56.39,47.24 v55.88,47.24
TWI_CLOCK  (via drill 0.6 pad 0.25)
  Top 0.254: v55.12,40.64 55.12,44.7 52.83,46.99 52.83,53.34 51.31,53.34 | 51.31,53.34 46.99,53.34 46.98,54.86 COMPASS.1 | R8.2 51.05,53.59 51.31,53.34
  Bottom 0.254: MPU.28 49.25,13.44 49.28,13.46 49.28,18.29 52.58,18.29 53.34,17.53 54.36,17.53 57.15,20.32 57.15,38.61 v55.12,40.64
TWI_DATA  (via drill 0.6 pad 0.25)
  Top 0.254: v53.59,12.19 52.58,18.29 55.63,21.34 55.63,38.1 50.8,42.93 50.8,45.47 45.72,45.47 45.72,49.02 43.69,51.05 43.69,51.31 | 43.69,51.31 43.69,54.11 COMPASS.16 | R9.2 44.2,51.82 43.69,51.31
  Bottom 0.254: MPU.31 48.26,11.94 48.26,12.45 52.07,12.45 v53.59,12.19
USB+5V
  Bottom 0.254: R4.1 26.16,42.42 X1.1 19.3,46.23 19.05,50.55 2.A
USB_CONNECTED  (via drill 0.6 pad 0.25)
  Top 0.254: v38.35,19.05 38.1,18.8 27.43,18.8 v23.62,20.07
  Bottom 0.254: MPU.12 38.81,15.04 38.1,15.75 38.1,19.05 v38.35,19.05 | v23.62,20.07 R5.2 R4.2
VDDCORE  (via drill 0.6 pad 0.25)
  Top 0.254: v39.12,7.37 39.12,6.6 46.23,6.6 v46.99,7.37
  Bottom 0.254: C4.1 C5.1 36.07,14.48 36.07,12.95 MPU.8 40.13,12.95 | 40.13,12.95 40.64,12.95 40.64,14.48 42.16,14.48 43.69,11.94 MPU.41 43.69,7.11 44.2,6.6 46.23,6.6 v46.99,7.37 | MPU.18 42.67,15.24 42.42,14.99 40.13,14.99 40.13,12.95 | MPU.48 39.83,8.08 v39.12,7.37
XIN  (via drill 0.6 pad 0.25)
  Top 0.254: v41.66,11.18 43.43,11.18 43.43,9.14 25.15,9.14 24.64,9.65 Q1.2 26.58,13.37 C6.1
  Bottom 0.254: MPU.46 41.15,8.1 41.15,10.92 41.4,11.18 v41.66,11.18
XOUT  (via drill 0.6 pad 0.25)
  Top 0.254: v42.16,10.16 41.91,9.91 34.29,9.91 Q1.1 32.35,13.37 C7.1
  Bottom 0.254: MPU.45 41.66,8.1 41.66,10.16 v42.16,10.16